# Altium schematic sheet VGA.SchDoc (part 1 of 3)
size Letter; DrawnBy: Titan Yuan; SheetNumber: 4; SheetTotal: 8
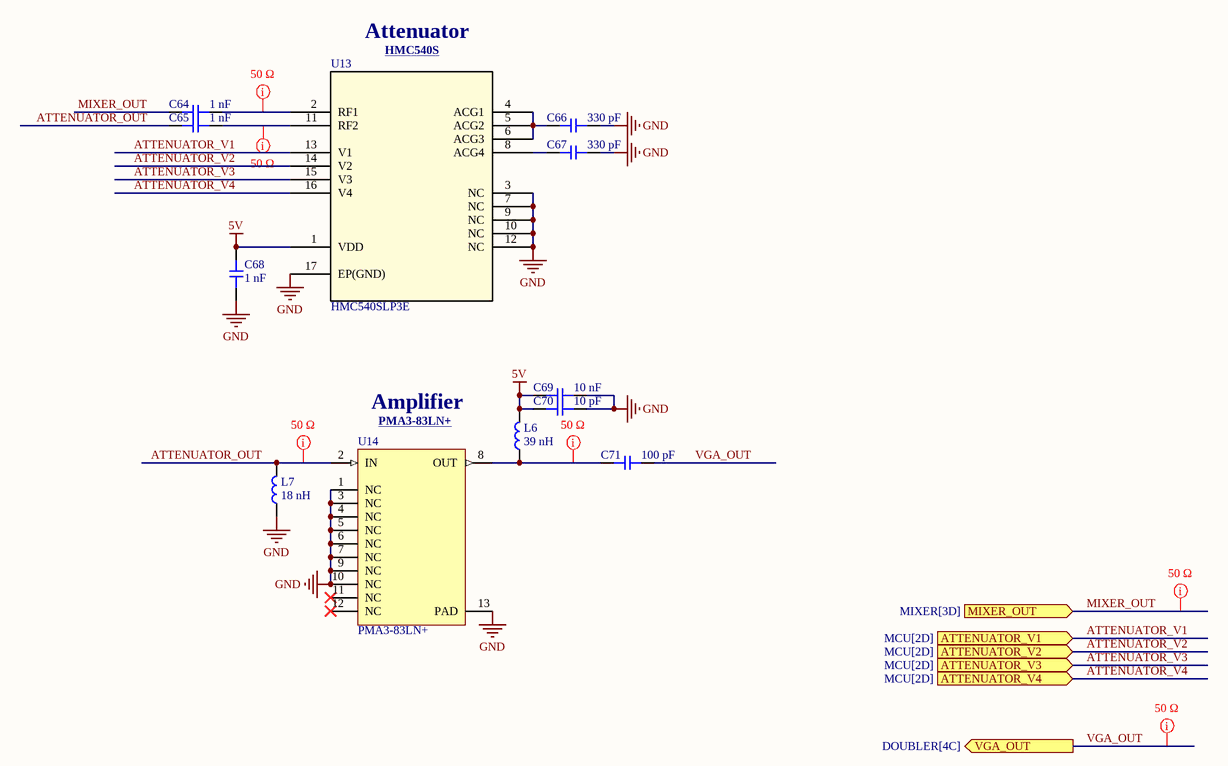
[diagram p0: VGA.SchDoc]

## Parts
C64  1 nF  [CAP_0402]
C65  1 nF  [CAP_0402]
C66  330 pF  [CAP_0402]
C67  330 pF  [CAP_0402]
C68  1 nF  [CAP_0402]
C69  10 nF  [CAP_0402]
C70  10 pF  [CAP_0402]
C71  100 pF  [CAP_0402]
L6  39 nH  [IND_0402]
L7  18 nH  [IND_0402]
U13  HMC540SLP3E  [HCP_16_1_ADI]
U14  PMA3-83LN+  [PL-456]

## Ports
ATTENUATOR_V1 (in, see MCU[2D]), ATTENUATOR_V2 (in, see MCU[2D]), ATTENUATOR_V3 (in, see MCU[2D]), ATTENUATOR_V4 (in, see MCU[2D]), MIXER_OUT (in, see MIXER[3D]), VGA_OUT (out, see DOUBLER[4C])

## Nets
5V: C68.2 C69.1 C70.1 L6.2 U13.1(VDD)
GND: C66.2 C67.2 C68.1 C69.2 C70.2 L7.1 U13.3(NC) U13.7(NC) U13.9(NC) U13.10(NC) U13.12(NC) U13.17(EP(GND)) U14.1(NC) U14.3(NC) U14.4(NC) U14.5(NC) U14.6(NC) U14.7(NC) U14.9(NC) U14.10(NC) U14.13(PAD)
ATTENUATOR_OUT: C65.2 L7.2 U14.2(IN)
ATTENUATOR_V1: U13.13(V1) ; port ATTENUATOR_V1
ATTENUATOR_V2: U13.14(V2) ; port ATTENUATOR_V2
ATTENUATOR_V3: U13.15(V3) ; port ATTENUATOR_V3
ATTENUATOR_V4: U13.16(V4) ; port ATTENUATOR_V4
MIXER_OUT: C64.2 ; port MIXER_OUT
VGA_OUT: C71.1 ; port VGA_OUT
NetC64_1: C64.1 U13.2(RF1)
NetC65_1: C65.1 U13.11(RF2)
NetC66_1: C66.1 U13.4(ACG1) U13.5(ACG2) U13.6(ACG3)
NetC67_1: C67.1 U13.8(ACG4)
NetC71_2: C71.2 L6.1 U14.8(OUT)

Not connected (* = marked no-connect by the designer): U14 11(NC)* 12(NC)*

## Layout directives
net class 50 Ω: ATTENUATOR_OUT, MIXER_OUT, NetC64_1, NetC65_1, NetC71_2, VGA_OUT

## Notes on the sheet
- Attenuator
- HMC540S <https://www.analog.com/en/products/hmc540s.html>
- Amplifier
- (near U14) PMA3-83LN+ <https://www.minicircuits.com/WebStore/dashboard.html?model=PMA3-83LN%2B>